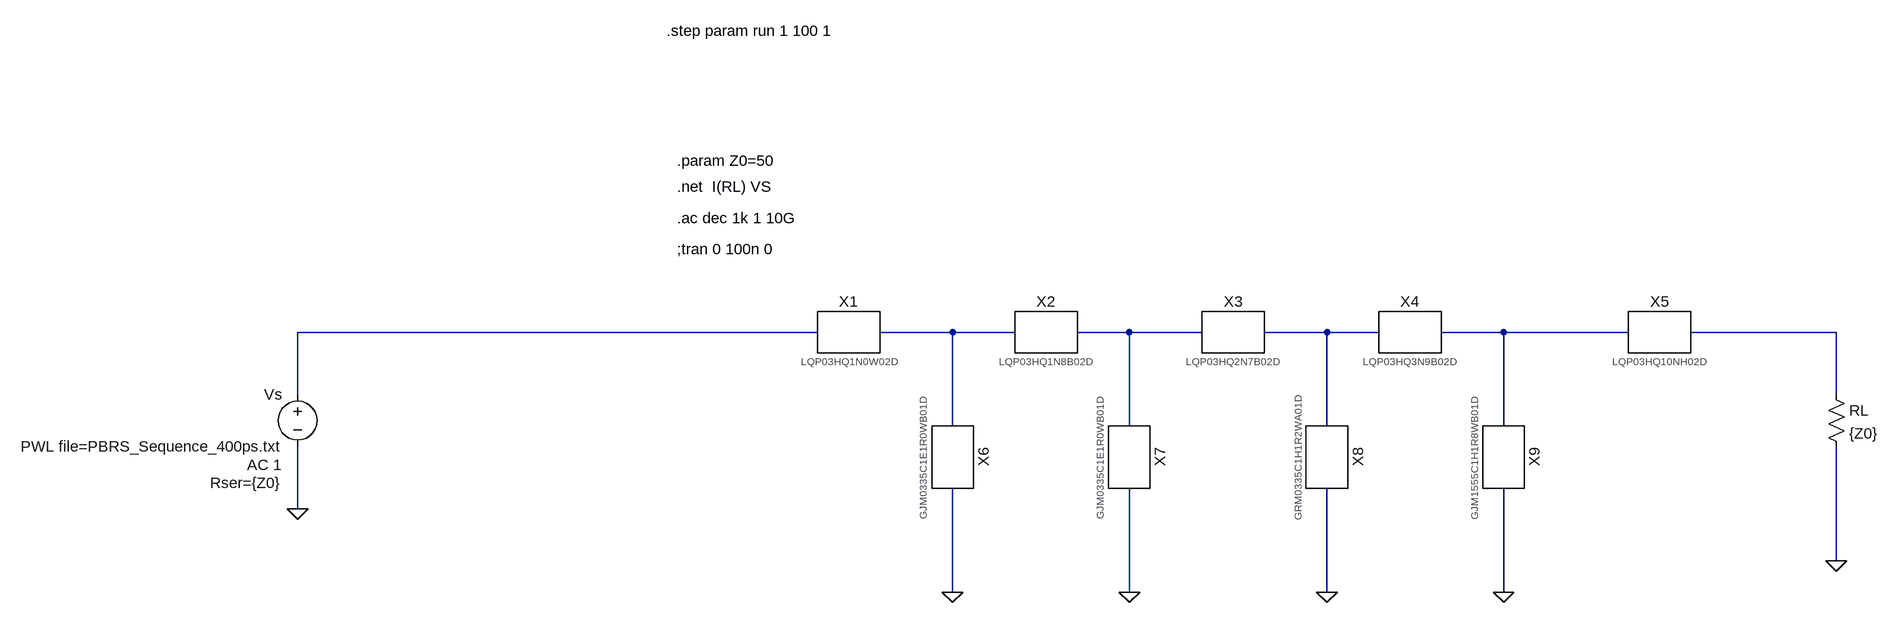
[diagram p0: schematic 1p75GHz_9th_Order_Bessel_Pulse_Shaping_Filter.asc]
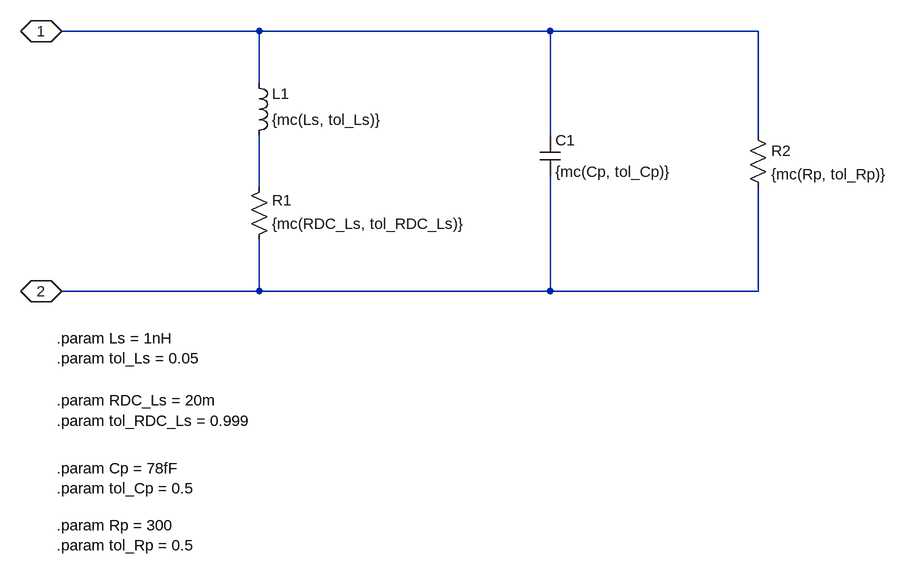
[diagram p1: sub-circuit lqp03hq1n0w02d.asc]
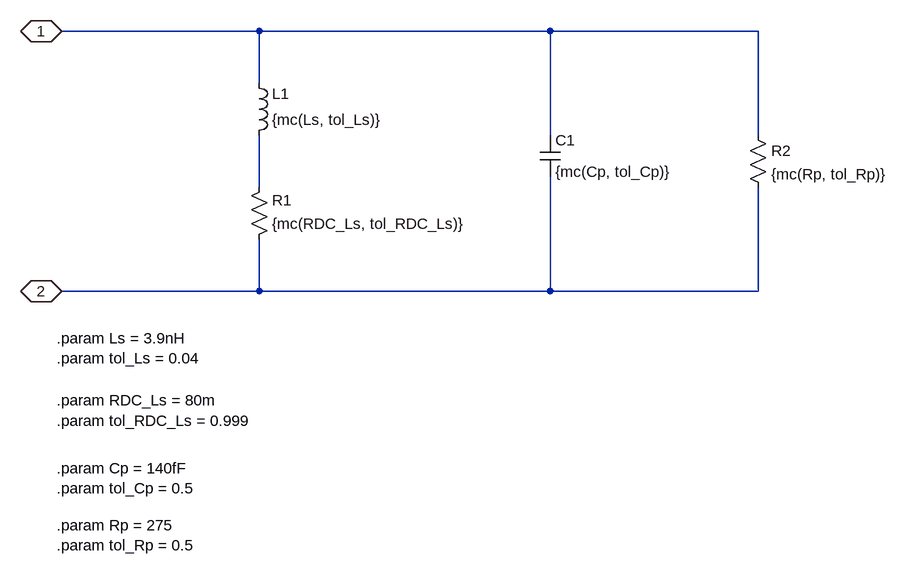
[diagram p2: sub-circuit lqp03hq3n9b02d.asc]
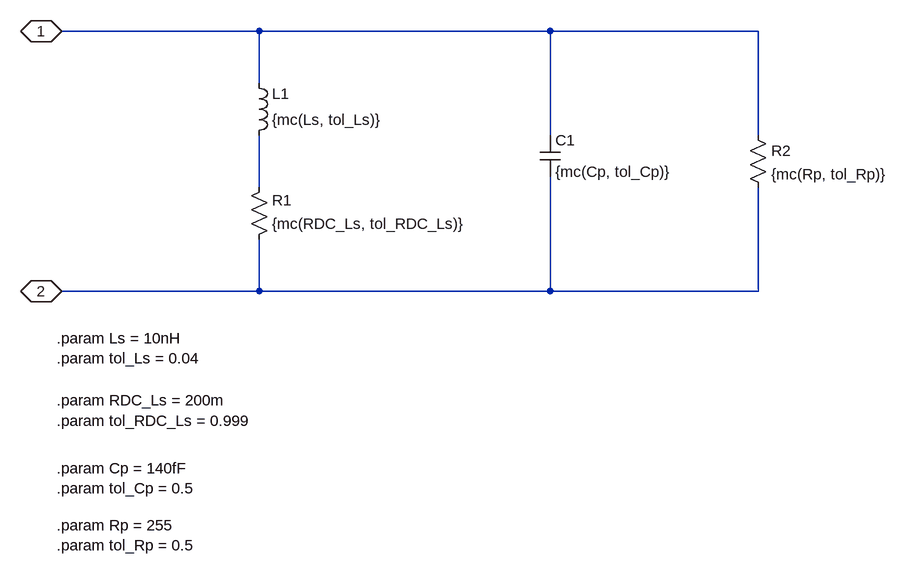
[diagram p3: sub-circuit lqp03hq10nh02d.asc]
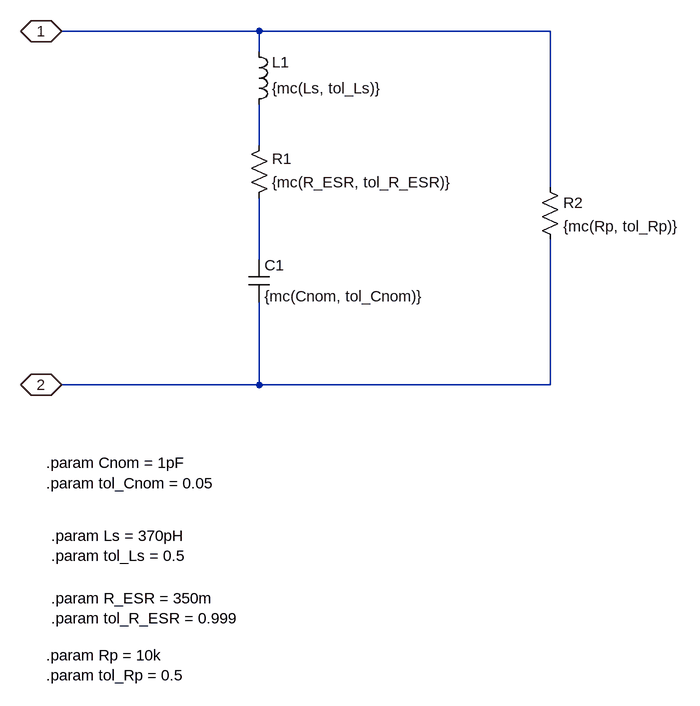
[diagram p4: sub-circuit gjm0335c1e1r0wb01d.asc]
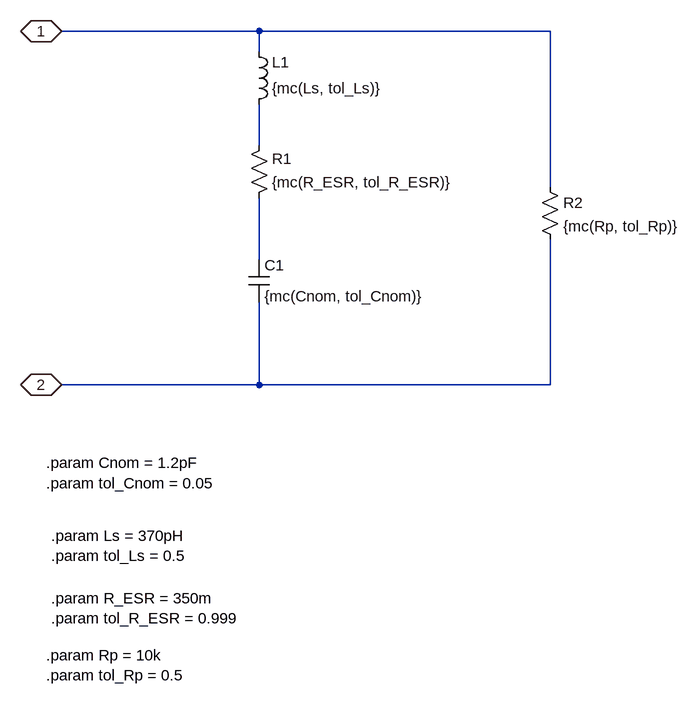
[diagram p5: sub-circuit grm0335c1h1r2wa01d.asc]
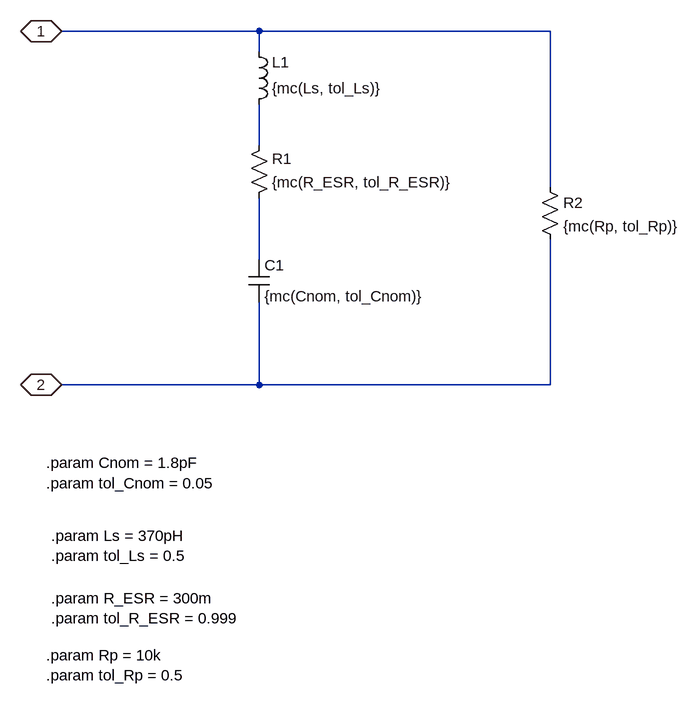
[diagram p6: sub-circuit gjm1555c1h1r8wb01d.asc]
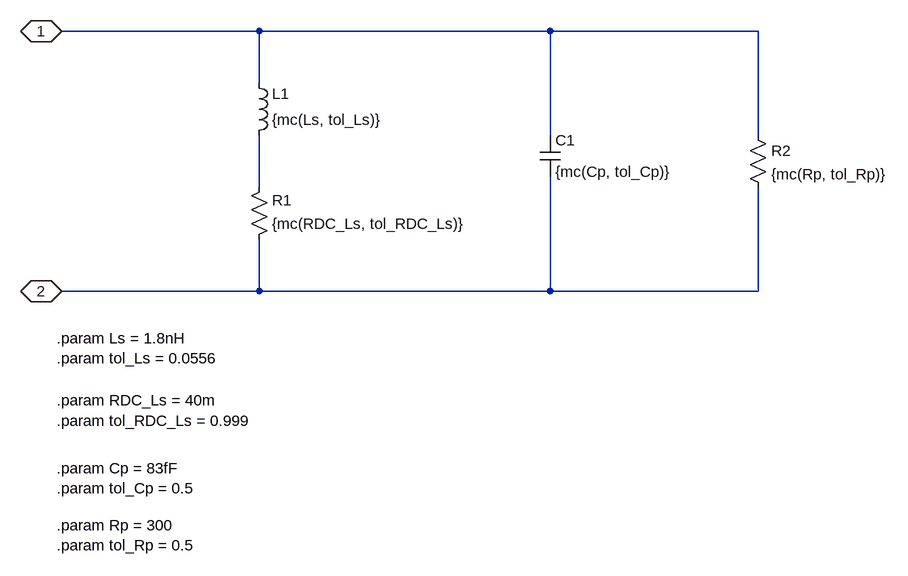
[diagram p7: sub-circuit lqp03hq1n8b02d.asc]
1p75GHz_9th_Order_Bessel_Pulse_Shaping_Filter.asc, the LTspice schematic file:
Version 4
SHEET 1 1792 740
WIRE 144 -96 -656 -96
WIRE 352 -96 240 -96
WIRE 448 -96 352 -96
WIRE 624 -96 544 -96
WIRE 736 -96 624 -96
WIRE 928 -96 832 -96
WIRE 1008 -96 928 -96
WIRE 1200 -96 1104 -96
WIRE 1392 -96 1200 -96
WIRE 1712 -96 1488 -96
WIRE -656 0 -656 -96
WIRE 1712 0 1712 -96
WIRE 352 48 352 -96
WIRE 624 48 624 -96
WIRE 928 48 928 -96
WIRE 1200 48 1200 -96
WIRE -656 176 -656 80
WIRE 1712 256 1712 80
WIRE 352 304 352 144
WIRE 624 304 624 144
WIRE 928 304 928 144
WIRE 1200 304 1200 144
FLAG -656 176 0
FLAG 1712 256 0
FLAG 1200 304 0
FLAG 928 304 0
FLAG 624 304 0
FLAG 352 304 0
SYMBOL voltage -656 -16 M0
WINDOW 123 24 124 Left 2
WINDOW 39 24 152 Left 2
SYMATTR Value2 AC 1
SYMATTR SpiceLine Rser={Z0}
SYMATTR InstName Vs
SYMATTR Value PWL file=PBRS_Sequence_400ps.txt
SYMBOL res 1696 -16 R0
SYMATTR InstName RL
SYMATTR Value {Z0}
SYMBOL LQP03HQ1N0W02D 192 -96 R0
SYMATTR InstName X1
SYMBOL LQP03HQ3N9B02D 1056 -96 R0
SYMATTR InstName X4
SYMBOL LQP03HQ10NH02D 1440 -96 R0
SYMATTR InstName X5
SYMBOL GJM0335C1E1R0WB01D 352 96 R90
SYMATTR InstName X6
SYMBOL GJM0335C1E1R0WB01D 624 96 R90
SYMATTR InstName X7
SYMBOL GRM0335C1H1R2WA01D 928 96 R90
SYMATTR InstName X8
SYMBOL GJM1555C1H1R8WB01D 1200 96 R90
SYMATTR InstName X9
SYMBOL LQP03HQ1N8B02D 496 -96 R0
SYMATTR InstName X2
SYMBOL LQP03HQ2N7B02D 784 -96 R0
SYMATTR InstName X3
TEXT -72 -320 Left 2 !.net  I(RL) VS
TEXT -72 -360 Left 2 !.param Z0=50
TEXT -72 -272 Left 2 !.ac dec 1k 1 10G
TEXT -72 -224 Left 2 !;tran 0 100n 0
TEXT -88 -560 Left 2 !.step param run 1 100 1

lqp03hq1n0w02d.asc, the sub-circuit schematic file:
Version 4
SHEET 1 1332 1072
WIRE 336 48 32 48
WIRE 784 48 336 48
WIRE 1104 48 784 48
WIRE 336 128 336 48
WIRE 784 208 784 48
WIRE 1104 208 1104 48
WIRE 336 288 336 208
WIRE 336 448 336 368
WIRE 336 448 32 448
WIRE 784 448 784 272
WIRE 784 448 336 448
WIRE 1104 448 1104 288
WIRE 1104 448 784 448
FLAG 32 448 2
IOPIN 32 448 BiDir
FLAG 32 48 1
IOPIN 32 48 BiDir
SYMBOL ind 320 224 M180
WINDOW 0 36 80 Left 2
WINDOW 3 36 40 Left 2
SYMATTR InstName L1
SYMATTR Value {mc(Ls, tol_Ls)}
SYMBOL res 320 384 M180
WINDOW 0 36 76 Left 2
WINDOW 3 36 40 Left 2
SYMATTR InstName R1
SYMATTR Value {mc(RDC_Ls, tol_RDC_Ls)}
SYMBOL cap 768 208 R0
SYMATTR InstName C1
SYMATTR Value {mc(Cp, tol_Cp)}
SYMBOL res 1088 192 R0
SYMATTR InstName R2
SYMATTR Value {mc(Rp, tol_Rp)}
TEXT 24 520 Left 2 !.param Ls = 1nH\n.param tol_Ls = 0.05
TEXT 24 616 Left 2 !.param RDC_Ls = 20m\n.param tol_RDC_Ls = 0.999
TEXT 24 720 Left 2 !.param Cp = 78fF\n.param tol_Cp = 0.5
TEXT 24 808 Left 2 !.param Rp = 300\n.param tol_Rp = 0.5

lqp03hq3n9b02d.asc, the sub-circuit schematic file:
Version 4
SHEET 1 1332 1072
WIRE 336 48 32 48
WIRE 784 48 336 48
WIRE 1104 48 784 48
WIRE 336 128 336 48
WIRE 784 208 784 48
WIRE 1104 208 1104 48
WIRE 336 288 336 208
WIRE 336 448 336 368
WIRE 336 448 32 448
WIRE 784 448 784 272
WIRE 784 448 336 448
WIRE 1104 448 1104 288
WIRE 1104 448 784 448
FLAG 32 448 2
IOPIN 32 448 BiDir
FLAG 32 48 1
IOPIN 32 48 BiDir
SYMBOL ind 320 224 M180
WINDOW 0 36 80 Left 2
WINDOW 3 36 40 Left 2
SYMATTR InstName L1
SYMATTR Value {mc(Ls, tol_Ls)}
SYMBOL res 320 384 M180
WINDOW 0 36 76 Left 2
WINDOW 3 36 40 Left 2
SYMATTR InstName R1
SYMATTR Value {mc(RDC_Ls, tol_RDC_Ls)}
SYMBOL cap 768 208 R0
SYMATTR InstName C1
SYMATTR Value {mc(Cp, tol_Cp)}
SYMBOL res 1088 192 R0
SYMATTR InstName R2
SYMATTR Value {mc(Rp, tol_Rp)}
TEXT 24 520 Left 2 !.param Ls = 3.9nH\n.param tol_Ls = 0.04
TEXT 24 616 Left 2 !.param RDC_Ls = 80m\n.param tol_RDC_Ls = 0.999
TEXT 24 720 Left 2 !.param Cp = 140fF\n.param tol_Cp = 0.5
TEXT 24 808 Left 2 !.param Rp = 275\n.param tol_Rp = 0.5

lqp03hq10nh02d.asc, the sub-circuit schematic file:
Version 4
SHEET 1 1332 1072
WIRE 336 48 32 48
WIRE 784 48 336 48
WIRE 1104 48 784 48
WIRE 336 128 336 48
WIRE 784 208 784 48
WIRE 1104 208 1104 48
WIRE 336 288 336 208
WIRE 336 448 336 368
WIRE 336 448 32 448
WIRE 784 448 784 272
WIRE 784 448 336 448
WIRE 1104 448 1104 288
WIRE 1104 448 784 448
FLAG 32 448 2
IOPIN 32 448 BiDir
FLAG 32 48 1
IOPIN 32 48 BiDir
SYMBOL ind 320 224 M180
WINDOW 0 36 80 Left 2
WINDOW 3 36 40 Left 2
SYMATTR InstName L1
SYMATTR Value {mc(Ls, tol_Ls)}
SYMBOL res 320 384 M180
WINDOW 0 36 76 Left 2
WINDOW 3 36 40 Left 2
SYMATTR InstName R1
SYMATTR Value {mc(RDC_Ls, tol_RDC_Ls)}
SYMBOL cap 768 208 R0
SYMATTR InstName C1
SYMATTR Value {mc(Cp, tol_Cp)}
SYMBOL res 1088 192 R0
SYMATTR InstName R2
SYMATTR Value {mc(Rp, tol_Rp)}
TEXT 24 520 Left 2 !.param Ls = 10nH\n.param tol_Ls = 0.04
TEXT 24 616 Left 2 !.param RDC_Ls = 200m\n.param tol_RDC_Ls = 0.999
TEXT 24 720 Left 2 !.param Cp = 140fF\n.param tol_Cp = 0.5
TEXT 24 808 Left 2 !.param Rp = 255\n.param tol_Rp = 0.5

gjm0335c1e1r0wb01d.asc, the sub-circuit schematic file:
Version 4
SHEET 1 1332 1072
WIRE 336 -96 32 -96
WIRE 784 -96 336 -96
WIRE 336 -64 336 -96
WIRE 336 80 336 16
WIRE 784 144 784 -96
WIRE 336 256 336 160
WIRE 336 448 336 320
WIRE 336 448 32 448
WIRE 784 448 784 224
WIRE 784 448 336 448
FLAG 32 448 2
IOPIN 32 448 BiDir
FLAG 32 -96 1
IOPIN 32 -96 BiDir
SYMBOL ind 320 32 M180
WINDOW 0 36 80 Left 2
WINDOW 3 36 40 Left 2
SYMATTR InstName L1
SYMATTR Value {mc(Ls, tol_Ls)}
SYMBOL res 320 176 M180
WINDOW 0 36 76 Left 2
WINDOW 3 36 40 Left 2
SYMATTR InstName R1
SYMATTR Value {mc(R_ESR, tol_R_ESR)}
SYMBOL cap 320 256 R0
SYMATTR InstName C1
SYMATTR Value {mc(Cnom, tol_Cnom)}
SYMBOL res 768 128 R0
SYMATTR InstName R2
SYMATTR Value {mc(Rp, tol_Rp)}
TEXT 16 680 Left 2 !.param Ls = 370pH\n.param tol_Ls = 0.5
TEXT 16 776 Left 2 !.param R_ESR = 350m\n.param tol_R_ESR = 0.999
TEXT 8 568 Left 2 !.param Cnom = 1pF\n.param tol_Cnom = 0.05
TEXT 8 864 Left 2 !.param Rp = 10k\n.param tol_Rp = 0.5

grm0335c1h1r2wa01d.asc, the sub-circuit schematic file:
Version 4
SHEET 1 1332 1072
WIRE 336 -96 32 -96
WIRE 784 -96 336 -96
WIRE 336 -64 336 -96
WIRE 336 80 336 16
WIRE 784 144 784 -96
WIRE 336 256 336 160
WIRE 336 448 336 320
WIRE 336 448 32 448
WIRE 784 448 784 224
WIRE 784 448 336 448
FLAG 32 448 2
IOPIN 32 448 BiDir
FLAG 32 -96 1
IOPIN 32 -96 BiDir
SYMBOL ind 320 32 M180
WINDOW 0 36 80 Left 2
WINDOW 3 36 40 Left 2
SYMATTR InstName L1
SYMATTR Value {mc(Ls, tol_Ls)}
SYMBOL res 320 176 M180
WINDOW 0 36 76 Left 2
WINDOW 3 36 40 Left 2
SYMATTR InstName R1
SYMATTR Value {mc(R_ESR, tol_R_ESR)}
SYMBOL cap 320 256 R0
SYMATTR InstName C1
SYMATTR Value {mc(Cnom, tol_Cnom)}
SYMBOL res 768 128 R0
SYMATTR InstName R2
SYMATTR Value {mc(Rp, tol_Rp)}
TEXT 16 680 Left 2 !.param Ls = 370pH\n.param tol_Ls = 0.5
TEXT 16 776 Left 2 !.param R_ESR = 350m\n.param tol_R_ESR = 0.999
TEXT 8 568 Left 2 !.param Cnom = 1.2pF\n.param tol_Cnom = 0.05
TEXT 8 864 Left 2 !.param Rp = 10k\n.param tol_Rp = 0.5

gjm1555c1h1r8wb01d.asc, the sub-circuit schematic file:
Version 4
SHEET 1 1332 1072
WIRE 336 -96 32 -96
WIRE 784 -96 336 -96
WIRE 336 -64 336 -96
WIRE 336 80 336 16
WIRE 784 144 784 -96
WIRE 336 256 336 160
WIRE 336 448 336 320
WIRE 336 448 32 448
WIRE 784 448 784 224
WIRE 784 448 336 448
FLAG 32 448 2
IOPIN 32 448 BiDir
FLAG 32 -96 1
IOPIN 32 -96 BiDir
SYMBOL ind 320 32 M180
WINDOW 0 36 80 Left 2
WINDOW 3 36 40 Left 2
SYMATTR InstName L1
SYMATTR Value {mc(Ls, tol_Ls)}
SYMBOL res 320 176 M180
WINDOW 0 36 76 Left 2
WINDOW 3 36 40 Left 2
SYMATTR InstName R1
SYMATTR Value {mc(R_ESR, tol_R_ESR)}
SYMBOL cap 320 256 R0
SYMATTR InstName C1
SYMATTR Value {mc(Cnom, tol_Cnom)}
SYMBOL res 768 128 R0
SYMATTR InstName R2
SYMATTR Value {mc(Rp, tol_Rp)}
TEXT 16 680 Left 2 !.param Ls = 370pH\n.param tol_Ls = 0.5
TEXT 16 776 Left 2 !.param R_ESR = 300m\n.param tol_R_ESR = 0.999
TEXT 8 568 Left 2 !.param Cnom = 1.8pF\n.param tol_Cnom = 0.05
TEXT 8 864 Left 2 !.param Rp = 10k\n.param tol_Rp = 0.5

lqp03hq1n8b02d.asc, the sub-circuit schematic file:
Version 4
SHEET 1 1332 1072
WIRE 336 48 32 48
WIRE 784 48 336 48
WIRE 1104 48 784 48
WIRE 336 128 336 48
WIRE 784 208 784 48
WIRE 1104 208 1104 48
WIRE 336 288 336 208
WIRE 336 448 336 368
WIRE 336 448 32 448
WIRE 784 448 784 272
WIRE 784 448 336 448
WIRE 1104 448 1104 288
WIRE 1104 448 784 448
FLAG 32 448 2
IOPIN 32 448 BiDir
FLAG 32 48 1
IOPIN 32 48 BiDir
SYMBOL ind 320 224 M180
WINDOW 0 36 80 Left 2
WINDOW 3 36 40 Left 2
SYMATTR InstName L1
SYMATTR Value {mc(Ls, tol_Ls)}
SYMBOL res 320 384 M180
WINDOW 0 36 76 Left 2
WINDOW 3 36 40 Left 2
SYMATTR InstName R1
SYMATTR Value {mc(RDC_Ls, tol_RDC_Ls)}
SYMBOL cap 768 208 R0
SYMATTR InstName C1
SYMATTR Value {mc(Cp, tol_Cp)}
SYMBOL res 1088 192 R0
SYMATTR InstName R2
SYMATTR Value {mc(Rp, tol_Rp)}
TEXT 24 520 Left 2 !.param Ls = 1.8nH\n.param tol_Ls = 0.0556
TEXT 24 616 Left 2 !.param RDC_Ls = 40m\n.param tol_RDC_Ls = 0.999
TEXT 24 720 Left 2 !.param Cp = 83fF\n.param tol_Cp = 0.5
TEXT 24 808 Left 2 !.param Rp = 300\n.param tol_Rp = 0.5

lqp03hq2n7b02d.asc, the sub-circuit schematic file:
Version 4
SHEET 1 1332 1072
WIRE 336 48 32 48
WIRE 784 48 336 48
WIRE 1104 48 784 48
WIRE 336 128 336 48
WIRE 784 208 784 48
WIRE 1104 208 1104 48
WIRE 336 288 336 208
WIRE 336 448 336 368
WIRE 336 448 32 448
WIRE 784 448 784 272
WIRE 784 448 336 448
WIRE 1104 448 1104 288
WIRE 1104 448 784 448
FLAG 32 448 2
IOPIN 32 448 BiDir
FLAG 32 48 1
IOPIN 32 48 BiDir
SYMBOL ind 320 224 M180
WINDOW 0 36 80 Left 2
WINDOW 3 36 40 Left 2
SYMATTR InstName L1
SYMATTR Value {mc(Ls, tol_Ls)}
SYMBOL res 320 384 M180
WINDOW 0 36 76 Left 2
WINDOW 3 36 40 Left 2
SYMATTR InstName R1
SYMATTR Value {mc(RDC_Ls, tol_RDC_Ls)}
SYMBOL cap 768 208 R0
SYMATTR InstName C1
SYMATTR Value {mc(Cp, tol_Cp)}
SYMBOL res 1088 192 R0
SYMATTR InstName R2
SYMATTR Value {mc(Rp, tol_Rp)}
TEXT 24 520 Left 2 !.param Ls = 2.7nH\n.param tol_Ls = 0.04
TEXT 24 616 Left 2 !.param RDC_Ls = 60m\n.param tol_RDC_Ls = 0.999
TEXT 24 720 Left 2 !.param Cp = 94fF\n.param tol_Cp = 0.5
TEXT 24 808 Left 2 !.param Rp = 275\n.param tol_Rp = 0.5

The netlist it stands for:
* 1p75GHz_9th_Order_Bessel_Pulse_Shaping_Filter.asc
Vs N001 0 PWL file=PBRS_Sequence_400ps.txt AC 1 Rser={Z0}
RL N006 0 {Z0}
XX1 N001 N002 lqp03hq1n0w02d
XX4 N004 N005 lqp03hq3n9b02d
XX5 N005 N006 lqp03hq10nh02d
XX6 N002 0 gjm0335c1e1r0wb01d
XX7 N003 0 gjm0335c1e1r0wb01d
XX8 N004 0 grm0335c1h1r2wa01d
XX9 N005 0 gjm1555c1h1r8wb01d
XX2 N002 N003 lqp03hq1n8b02d
XX3 N003 N004 lqp03hq2n7b02d

* block symbol definitions
.subckt lqp03hq1n0w02d 1 2
L1 N001 1 {mc(Ls, tol_Ls)}
R1 2 N001 {mc(RDC_Ls, tol_RDC_Ls)}
C1 1 2 {mc(Cp, tol_Cp)}
R2 1 2 {mc(Rp, tol_Rp)}
.param Ls = 1nH
.param tol_Ls = 0.05
.param RDC_Ls = 20m
.param tol_RDC_Ls = 0.999
.param Cp = 78fF
.param tol_Cp = 0.5
.param Rp = 300
.param tol_Rp = 0.5
.ends lqp03hq1n0w02d

.subckt lqp03hq3n9b02d 1 2
L1 N001 1 {mc(Ls, tol_Ls)}
R1 2 N001 {mc(RDC_Ls, tol_RDC_Ls)}
C1 1 2 {mc(Cp, tol_Cp)}
R2 1 2 {mc(Rp, tol_Rp)}
.param Ls = 3.9nH
.param tol_Ls = 0.04
.param RDC_Ls = 80m
.param tol_RDC_Ls = 0.999
.param Cp = 140fF
.param tol_Cp = 0.5
.param Rp = 275
.param tol_Rp = 0.5
.ends lqp03hq3n9b02d

.subckt lqp03hq10nh02d 1 2
L1 N001 1 {mc(Ls, tol_Ls)}
R1 2 N001 {mc(RDC_Ls, tol_RDC_Ls)}
C1 1 2 {mc(Cp, tol_Cp)}
R2 1 2 {mc(Rp, tol_Rp)}
.param Ls = 10nH
.param tol_Ls = 0.04
.param RDC_Ls = 200m
.param tol_RDC_Ls = 0.999
.param Cp = 140fF
.param tol_Cp = 0.5
.param Rp = 255
.param tol_Rp = 0.5
.ends lqp03hq10nh02d

.subckt gjm0335c1e1r0wb01d 1 2
L1 N001 1 {mc(Ls, tol_Ls)}
R1 N002 N001 {mc(R_ESR, tol_R_ESR)}
C1 N002 2 {mc(Cnom, tol_Cnom)}
R2 1 2 {mc(Rp, tol_Rp)}
.param Ls = 370pH
.param tol_Ls = 0.5
.param R_ESR = 350m
.param tol_R_ESR = 0.999
.param Cnom = 1pF
.param tol_Cnom = 0.05
.param Rp = 10k
.param tol_Rp = 0.5
.ends gjm0335c1e1r0wb01d

.subckt grm0335c1h1r2wa01d 1 2
L1 N001 1 {mc(Ls, tol_Ls)}
R1 N002 N001 {mc(R_ESR, tol_R_ESR)}
C1 N002 2 {mc(Cnom, tol_Cnom)}
R2 1 2 {mc(Rp, tol_Rp)}
.param Ls = 370pH
.param tol_Ls = 0.5
.param R_ESR = 350m
.param tol_R_ESR = 0.999
.param Cnom = 1.2pF
.param tol_Cnom = 0.05
.param Rp = 10k
.param tol_Rp = 0.5
.ends grm0335c1h1r2wa01d

.subckt gjm1555c1h1r8wb01d 1 2
L1 N001 1 {mc(Ls, tol_Ls)}
R1 N002 N001 {mc(R_ESR, tol_R_ESR)}
C1 N002 2 {mc(Cnom, tol_Cnom)}
R2 1 2 {mc(Rp, tol_Rp)}
.param Ls = 370pH
.param tol_Ls = 0.5
.param R_ESR = 300m
.param tol_R_ESR = 0.999
.param Cnom = 1.8pF
.param tol_Cnom = 0.05
.param Rp = 10k
.param tol_Rp = 0.5
.ends gjm1555c1h1r8wb01d

.subckt lqp03hq1n8b02d 1 2
L1 N001 1 {mc(Ls, tol_Ls)}
R1 2 N001 {mc(RDC_Ls, tol_RDC_Ls)}
C1 1 2 {mc(Cp, tol_Cp)}
R2 1 2 {mc(Rp, tol_Rp)}
.param Ls = 1.8nH
.param tol_Ls = 0.0556
.param RDC_Ls = 40m
.param tol_RDC_Ls = 0.999
.param Cp = 83fF
.param tol_Cp = 0.5
.param Rp = 300
.param tol_Rp = 0.5
.ends lqp03hq1n8b02d

.subckt lqp03hq2n7b02d 1 2
L1 N001 1 {mc(Ls, tol_Ls)}
R1 2 N001 {mc(RDC_Ls, tol_RDC_Ls)}
C1 1 2 {mc(Cp, tol_Cp)}
R2 1 2 {mc(Rp, tol_Rp)}
.param Ls = 2.7nH
.param tol_Ls = 0.04
.param RDC_Ls = 60m
.param tol_RDC_Ls = 0.999
.param Cp = 94fF
.param tol_Cp = 0.5
.param Rp = 275
.param tol_Rp = 0.5
.ends lqp03hq2n7b02d

.net  I(RL) VS
.param Z0=50
.ac dec 1k 1 10G
;tran 0 100n 0
.step param run 1 100 1
.backanno
.end